# EAGLE design XmasTreeCard (EAGLE 7.1.0)
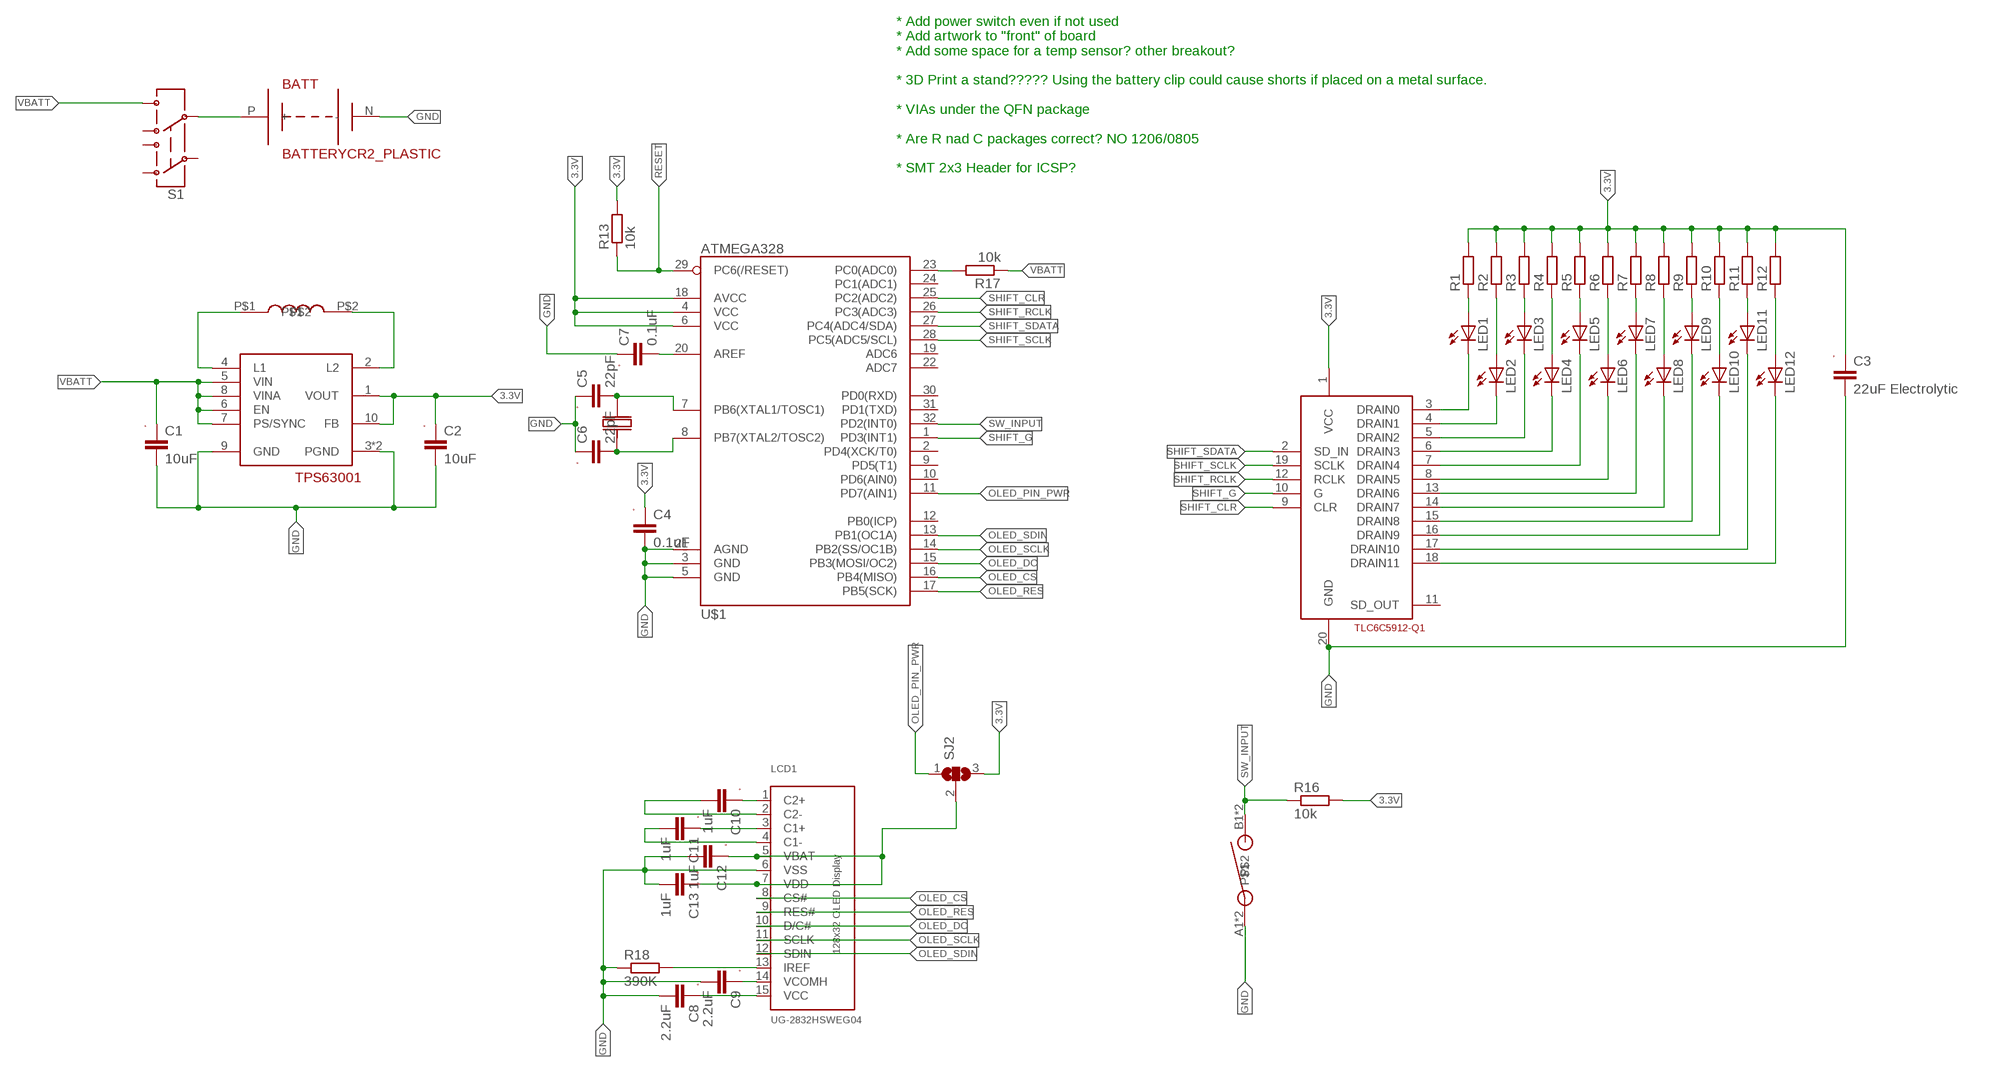
[diagram p0: schematic, sheet 1]

## Parts
BATT  BATTERYCR2_PLASTIC  [BATT_SMD_CR2_PLASTIC]
C1  10uF  C-EUC1206  [C1206]
C2  10uF  C-EUC1206  [C1206]
C3  22uF Electrolytic  C-EUAVX_TAJ_P  [CAP_2012-15]
C4  0.1uF  C-EUC0805K  [C0805K]
C5  22pF  C-EUC0805K  [C0805K]
C6  22pF  C-EUC0805K  [C0805K]
C7  0.1uF  C-EUC0805K  [C0805K]
C8  2.2uF  C-EUC1206  [C1206]
C9  2.2uF  C-EUC1206  [C1206]
C10  1uF  C-EUC1206  [C1206]
C11  1uF  C-EUC1206  [C1206]
C12  1uF  C-EUC1206  [C1206]
C13  1uF  C-EUC1206  [C1206]
LCD1  UG-2832HSWEG04  OLED_UG-2832HSWEG04FOLDAROUND  [UG-283HSWEG04_FOLDAROUND]
LED1  LEDCHIPLED_0805  [CHIPLED_0805]
LED2  LEDCHIPLED_0805  [CHIPLED_0805]
LED3  LEDCHIPLED_0805  [CHIPLED_0805]
LED4  LEDCHIPLED_0805  [CHIPLED_0805]
LED5  LEDCHIPLED_0805  [CHIPLED_0805]
LED6  LEDCHIPLED_0805  [CHIPLED_0805]
LED7  LEDCHIPLED_0805  [CHIPLED_0805]
LED8  LEDCHIPLED_0805  [CHIPLED_0805]
LED9  LEDCHIPLED_0805  [CHIPLED_0805]
LED10  LEDCHIPLED_0805  [CHIPLED_0805]
LED11  LEDCHIPLED_0805  [CHIPLED_0805]
LED12  LEDCHIPLED_0805  [CHIPLED_0805]
R1  R-EUR0805  [R0805]
R2  R-EUR0805  [R0805]
R3  R-EUR0805  [R0805]
R4  R-EUR0805  [R0805]
R5  R-EUR0805  [R0805]
R6  R-EUR0805  [R0805]
R7  R-EUR0805  [R0805]
R8  R-EUR0805  [R0805]
R9  R-EUR0805  [R0805]
R10  R-EUR0805  [R0805]
R11  R-EUR0805  [R0805]
R12  R-EUR0805  [R0805]
R13  10k  R-EUR0805  [R0805]
R16  10k  R-EUR0805  [R0805]
R17  10k  R-EUR0805  [R0805]
R18  390K  R-EUR0805  [R0805]
S1  SWITCH-DPDTMMS228  [MMS_228_T]
SJ2  SJ2W  [SJ_2]
SW1  SWITCH_SPST6X6TACTILE  [SWITCH_SPST_6X6_TACTILE]
U$1  ATMEGA328  ATMEGA328_SMT  [TQFP32-08]
U$2  COILCRAFT_LPS4012  [COILCRAFT_LPS4012]
U$3  TPS63001DRC  [QFN10_3X3MM]
U$4  TLC6C5912-Q1  [TSSOP-20]
U$5  CRYSTAL_ABM03  [ABM_CRYSTAL]

## Nets
3.3V: C2.1 C3.P C4.1 R1.2 R2.2 R3.2 R4.2 R5.2 R6.2 R7.2 R8.2 R9.2 R10.2 R11.2 R12.2 R13.2 R16.2 SJ2.3 U$1.4(VCC) U$1.6(VCC) U$1.18(AVCC) U$3.1(VOUT) U$3.10(FB) U$4.1(VCC)
GND: BATT.N(-) C1.2 C2.2 C3.N C4.2 C5.1 C6.1 C7.1 C8.2 C9.2 C12.2 C13.2 LCD1.6(VSS) R18.1 SW1.A1 SW1.A2 U$1.3(GND) U$1.5(GND) U$1.21(AGND) U$3.3(PGND) U$3.9(GND) U$3.11(PGND) U$4.20(GND)
N$1: U$2.P$1 U$3.4(L1)
N$2: U$2.P$2 U$3.2(L2)
N$3: LED1.A R1.1
N$4: LED2.A R2.1
N$5: LED3.A R3.1
N$6: LED4.A R4.1
N$7: LED5.A R5.1
N$8: LED6.A R6.1
N$9: LED7.A R7.1
N$10: LED8.A R8.1
N$11: LED9.A R9.1
N$12: LED10.A R10.1
N$13: LED11.A R11.1
N$14: LED12.A R12.1
N$15: LED1.C U$4.3(DRAIN0)
N$16: LED2.C U$4.4(DRAIN1)
N$17: LED3.C U$4.5(DRAIN2)
N$18: LED4.C U$4.6(DRAIN3)
N$19: LED5.C U$4.7(DRAIN4)
N$20: LED6.C U$4.8(DRAIN5)
N$21: LED7.C U$4.13(DRAIN6)
N$22: LED8.C U$4.14(DRAIN7)
N$23: LED9.C U$4.15(DRAIN8)
N$24: LED10.C U$4.16(DRAIN9)
N$25: LED11.C U$4.17(DRAIN10)
N$26: LED12.C U$4.18(DRAIN11)
N$27: C5.2 U$1.7(PB6(XTAL1/TOSC1)) U$5.2
N$28: BATT.P(+) S1.6
N$29: C6.2 U$1.8(PB7(XTAL2/TOSC2)) U$5.1
N$30: C7.2 U$1.20(AREF)
N$39: R17.2 U$1.23(PC0(ADC0))
N$40: C10.2 LCD1.2(C2-)
N$41: C10.1 LCD1.1(C2+)
N$42: C11.2 LCD1.4(C1-)
N$43: C11.1 LCD1.3(C1+)
N$44: LCD1.13(IREF) R18.2
N$45: C9.1 LCD1.14(VCOMH)
N$51: C8.1 LCD1.15(VCC)
N$52: C12.1 C13.1 LCD1.5(VBAT) LCD1.7(VDD) SJ2.2
OLED_CS: LCD1.8(CS#) U$1.16(PB4(MISO))
OLED_DC: LCD1.10(D/C#) U$1.15(PB3(MOSI/OC2))
OLED_PIN_PWR: SJ2.1 U$1.11(PD7(AIN1))
OLED_RES: LCD1.9(RES#) U$1.17(PB5(SCK))
OLED_SCLK: LCD1.11(SCLK) U$1.14(PB2(SS/OC1B))
OLED_SDIN: LCD1.12(SDIN) U$1.13(PB1(OC1A))
RESET: R13.1 U$1.29(PC6(/RESET))
SHIFT_CLR: U$1.25(PC2(ADC2)) U$4.9(CLR)
SHIFT_G: U$1.1(PD3(INT1)) U$4.10(G)
SHIFT_RCLK: U$1.26(PC3(ADC3)) U$4.12(RCLK)
SHIFT_SCLK: U$1.28(PC5(ADC5/SCL)) U$4.19(SCLK)
SHIFT_SDATA: U$1.27(PC4(ADC4/SDA)) U$4.2(SD_IN)
SW_INPUT: R16.1 SW1.B1 SW1.B2 U$1.32(PD2(INT0))
VBATT: C1.1 R17.1 S1.7 U$3.5(VIN) U$3.6(EN) U$3.7(PS/SYNC) U$3.8(VINA)
Unconnected: S1.1 S1.2 S1.3 S1.5 U$1.2(PD4(XCK/T0)) U$1.9(PD5(T1)) U$1.10(PD6(AIN0)) U$1.12(PB0(ICP)) U$1.19(ADC6) U$1.22(ADC7) U$1.24(PC1(ADC1)) U$1.30(PD0(RXD)) U$1.31(PD1(TXD)) U$4.11(SD_OUT)

## Notes on the sheet
- * Add power switch even if not used
  * Add artwork to "front" of board
  * Add some space for a temp sensor? other breakout?
  
  * 3D Print a stand????? Using the battery clip could cause shorts if placed on a metal surface.
  
  * VIAs under the QFN package
  
  * Are R nad C packages correct? NO 1206/0805
  
  * SMT 2x3 Header for ICSP?

## Library data of the parts
BATT = mjholmes:BATTERY: Battery connector - SMT Snap in round cell holders for AA, AAA and CR2 Keystone P/N 53 See http://www.keyelco.com/product.cfm/For-CR2-Batteries/53/product_id/811
C1 C2 C4-C13 = mjholmes:C-EU: CAPACITOR, European symbol; SPICEPREFIX: C
C3 = mjholmes:C-EU: CAPACITOR, European symbol
LCD1 = mjholmes:OLED_UG-2832HSWEG04: 128x32 SPI 0.91" Monochrome OLED Display
LED1-LED12 = led:LED: LED OSRAM: - CHIPLED LG R971, LG N971, LY N971, LG Q971, LY Q971, LO R971, LY R971 LH N974, LH R974 LS Q976, LO Q976, LY Q976 LO Q996 - Hyper CHIPLED LW Q18S LB Q993, LB Q99A, LB R99A - SideLED LS A670, LO A670, LY A670, LG A670, LP A670 LB A673, LV A673, LT A673, LW A673 LH A674 LY A675 LS A676, LA A676, LO A676, LY A676, LW A676 LS A679, LY A679, LG A679 - Hyper Micro SIDELED® LS Y876, LA Y876, LO Y876, LY Y876 LT Y87S - SmartLED LW L88C, LW L88S LB L89C, LB L89S, LG L890 LS L89K, LO L89K, LY L89K LS L896, LA L896, LO L896, LY L896 - TOPLED LS T670, LO T670, LY T670, LG T670, LP T670 LSG T670, LSP T670, LSY T670, LOP T670, LYG T670 LG T671, LOG T671, LSG T671 LB T673, LV T673, LT T673, LW T673 LH T674 LS T676, LA T676, LO T676, LY T676, LB T676, LH T676, LSB T676, LW T676 LB T67C, LV T67C, LT T67C, LS T67K, LO T67K, LY T67K, LW E67C LS E67B, LA E67B, LO E67B, LY E67B, LB E67C, LV E67C, LT E67C LW T67C LS T679, LY T679, LG T679 LS T770, LO T770, LY T770, LG T770, LP T770 LB T773, LV T773, LT T773, LW T773 LH T774 LS E675, LA E675, LY E675, LS T675 LS T776, LA T776, LO T776, LY T776, LB T776 LHGB T686 LT T68C, LB T68C - Hyper Mini TOPLED® LB M676 - Mini TOPLED Santana® LG M470 LS M47K, LO M47K, LY M47K Source: http://www.osram.convergy.de LUXEON: - LUMILED® LXK2-PW12-R00, LXK2-PW12-S00, LXK2-PW14-U00, LXK2-PW14-V00 LXK2-PM12-R00, LXK2-PM12-S00, LXK2-PM14-U00 LXK2-PE12-Q00, LXK2-PE12-R00, LXK2-PE12-S00, LXK2-PE14-T00, LXK2-PE14-U00 LXK2-PB12-K00, LXK2-PB12-L00, LXK2-PB12-M00, LXK2-PB14-N00, LXK2-PB14-P00, LXK2-PB14-Q00 LXK2-PR12-L00, LXK2-PR12-M00, LXK2-PR14-Q00, LXK2-PR14-R00 LXK2-PD12-Q00, LXK2-PD12-R00, LXK2-PD12-S00 LXK2-PH12-R00, LXK2-PH12-S00 LXK2-PL12-P00, LXK2-PL12-Q00, LXK2-PL12-R00 Source: www.luxeon.com KINGBRIGHT: KA-3528ASYC Source: www.kingbright.com
R1-R13 R16-R18 = mjholmes:R-EU: RESISTOR, European symbol; SPICEPREFIX: R
S1 = mjholmes:SWITCH-DPDT: DPDT Version of the COM-00597
SJ2 = mjholmes:SJ2W: SMD solder JUMPER
SW1 = mjholmes:SWITCH_SPST: Mountain switch Part number 101-TS6923T2605-EV http://www.mouser.com/ds/2/209/MS-100637-199674.pdf
U$1 = mjholmes:ATMEGA328_SMT: Atmega328 TQFP or DIP28; FARNELL: 171-5486
U$2 = mjholmes:COILCRAFT_LPS4012: Coilcraft Shielded Power Inductors – LPS4012 See http://www.coilcraft.com/pdfs/lps4012.pdf Very low DCR; excellent current handling 4.0 × 4.0 mm footprint; less than 1.2 mm tall
U$3 = mjholmes:TPS63001: HIGH EFFICIENT SINGLE INDUCTOR BUCK-BOOST CONVERTER WITH 1.8-A SWITCHES
U$4 = mjholmes:TLC6C5912-Q1: TI Power Logic 12-CHANNEL SHIFT REGISTER LED DRIVER See http://www.ti.com/lit/ds/symlink/tlc6c5912-q1.pdf; MOUSER: 595-TLC6C5912QPWRQ1
U$5 = mjholmes:CRYSTAL

## Board
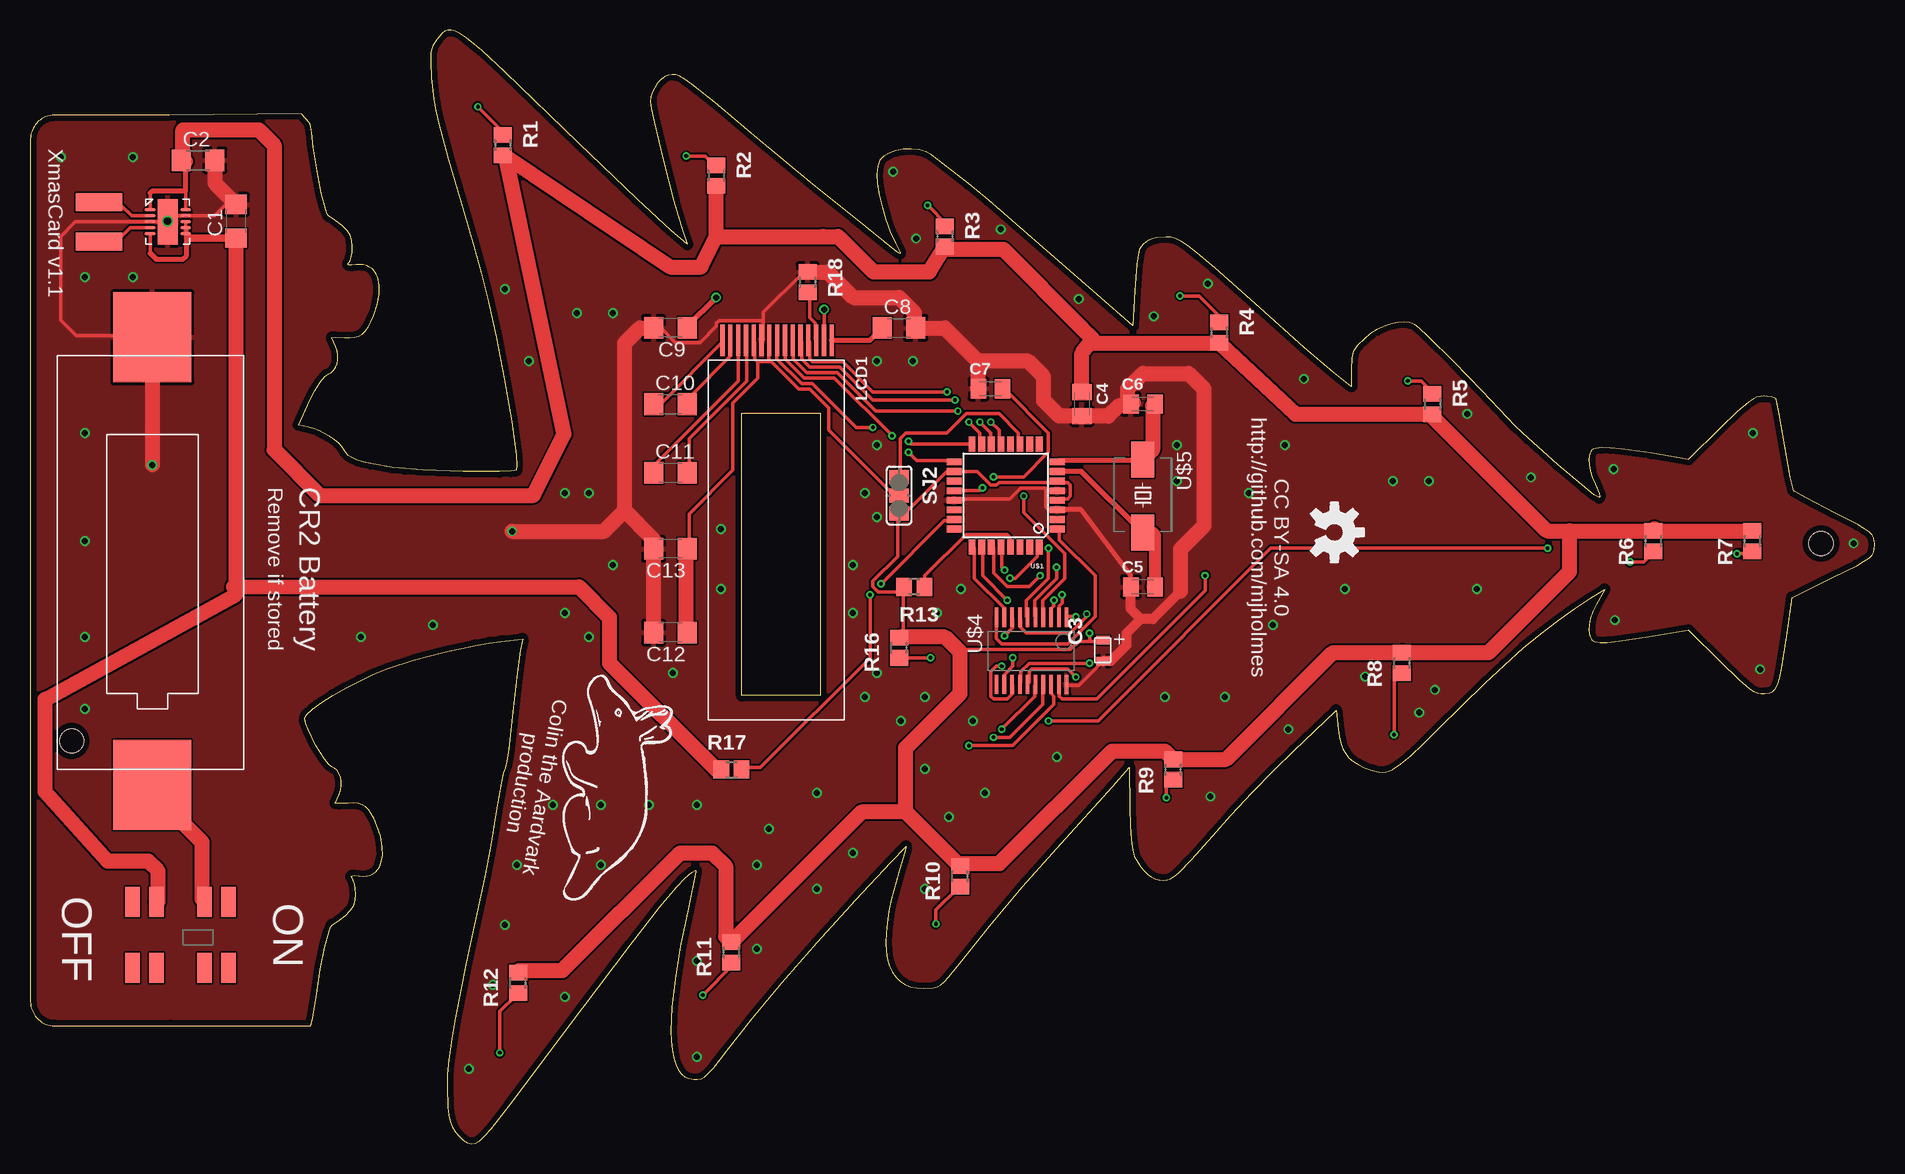
[diagram p1: board, top side]
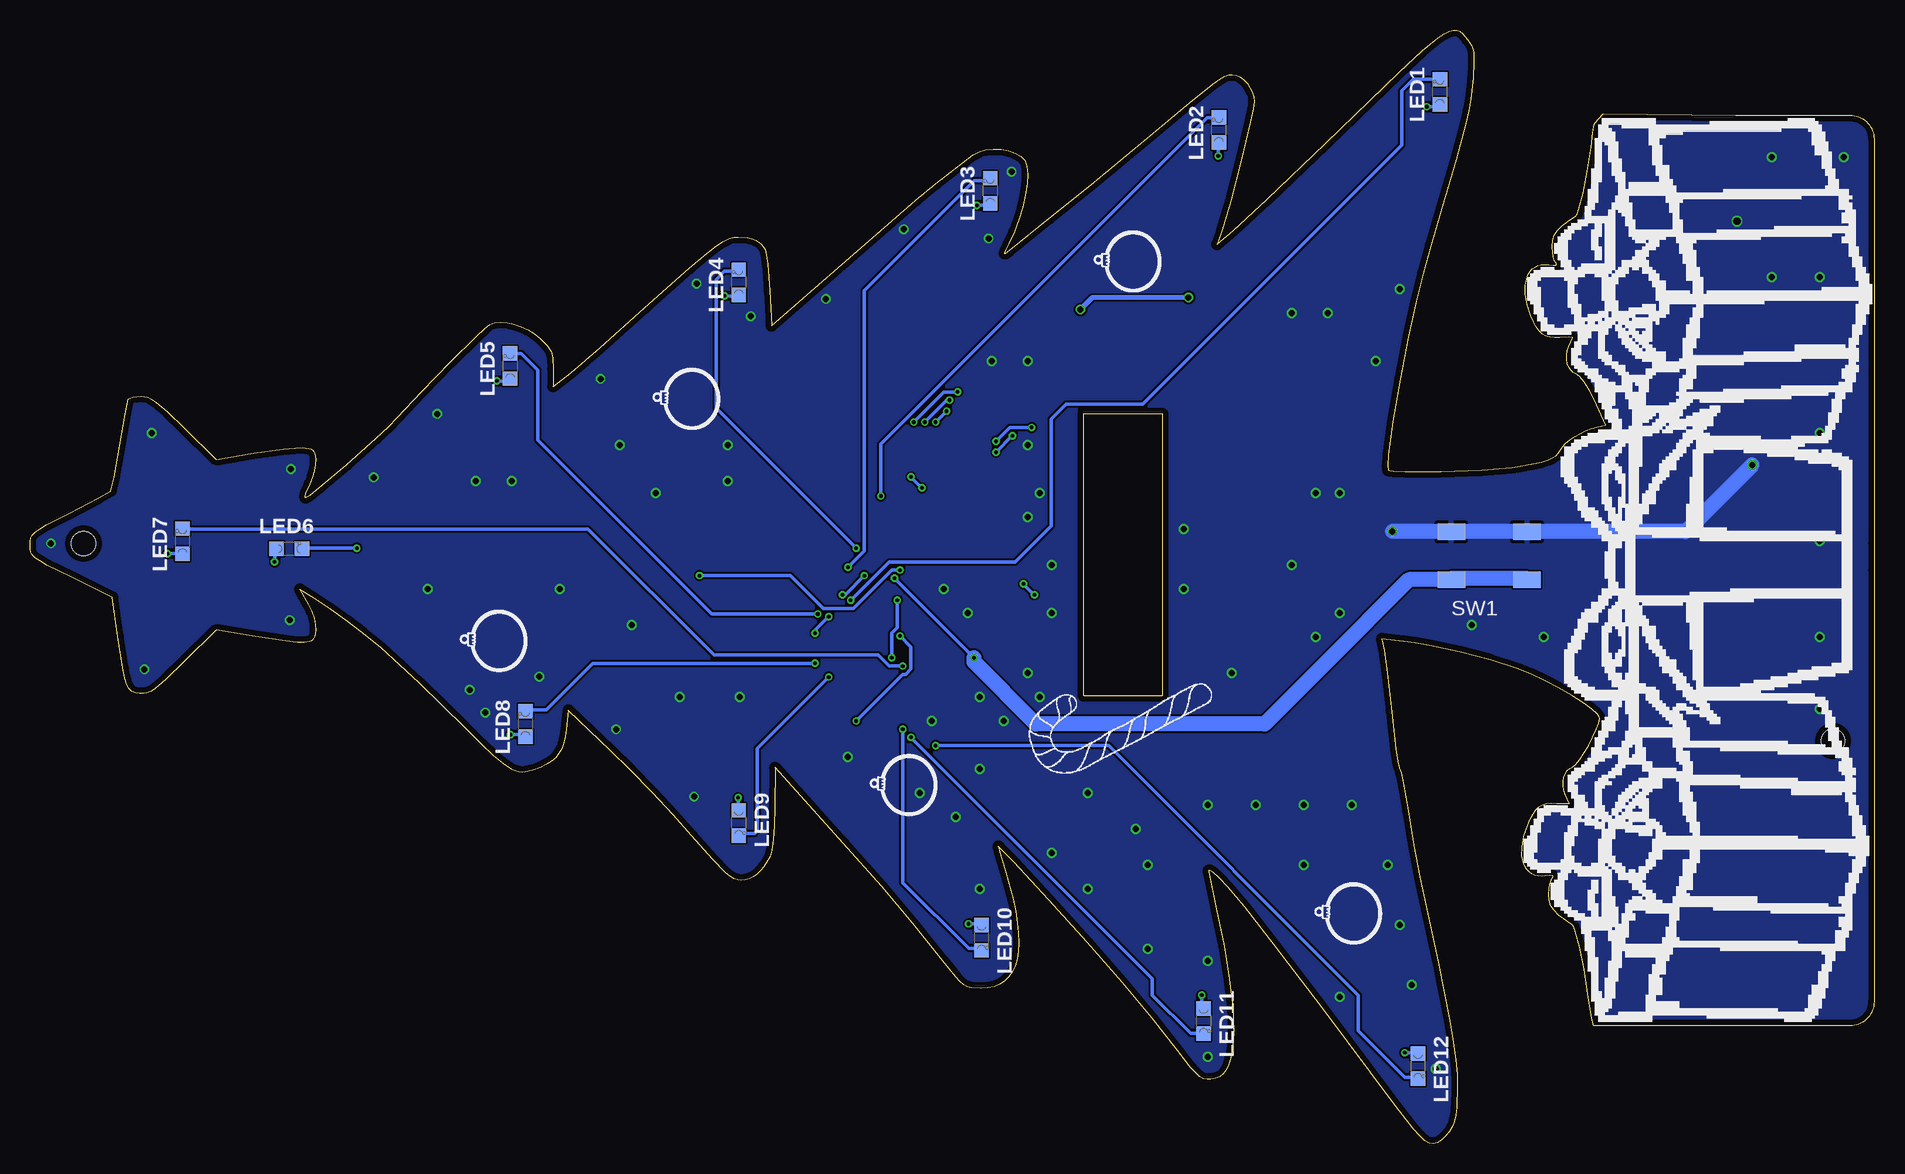
[diagram p2: board, bottom side, seen from below]

Size 153.67 x 92.85 mm. Coordinates in mm from the lower left corner, seen from the top.
Outline: 153.67,50.07 153.66,50.24 153.62,50.51 153.48,50.75 153.25,50.99 152.85,51.27 152.26,51.6 150.36,52.59 147.98,53.83 146.92,54.43 146.67,55.6 146.21,58.21 145.75,60.85 145.47,62.08 145.34,62.18 145.1,62.26 144.42,62.33 144.14,62.31 143.85,62.23 143.55,62.08 143.19,61.84 142.24,61.04 140.84,59.69 138.15,57.04 135.04,57.56 132.56,57.92 131.59,58.01 130.95,58.02 130.42,57.96 130.25,57.91 130.11,57.82 130.02,57.71 129.95,57.54 129.88,57.06 129.89,56.62 129.98,56.09 130.15,55.54 130.38,55.02 130.72,54.2 130.77,53.96 130.76,53.94 arc-52 130.71,53.86 130.33,54.09 129.55,54.69 127.26,56.61 124.8,58.83 123.79,59.79 123.08,60.52 121.04,62.71 118.6,65.2 116.48,67.3 115.75,67.98 115.35,68.3 114.93,68.45 114.45,68.5 113.91,68.46 113.34,68.34 112.76,68.14 112.19,67.87 111.65,67.53 111.17,67.13 110.58,66.53 110.38,66.27 110.24,66.02 110.15,65.75 110.1,65.44 110.07,64.61 110.07,63.13 108.58,64.3 106.16,66.37 102.42,69.69 98.72,72.99 97.5,74.04 96.61,74.76 95.95,75.21 95.45,75.47 95.04,75.57 94.63,75.59 93.84,75.53 93.5,75.44 93.2,75.33 92.95,75.18 92.73,75 92.55,74.79 92.41,74.54 92.31,74.12 92.21,73.33 92.03,71.12 91.86,68.19 88.9,70.79 81.83,76.98 79.85,78.65 78.18,80.03 75.08,82.45 74.59,82.7 74.01,82.86 73.39,82.92 72.74,82.89 72.13,82.78 71.57,82.59 71.1,82.32 70.78,81.98 70.67,81.77 70.6,81.51 70.54,80.84 70.58,80.02 70.72,79.08 70.96,78.07 71.27,77.03 71.67,76 72.12,75.02 72.39,74.47 72.47,74.24 72.44,74.22 72.35,74.25 72.03,74.48 68.72,77.14 65.23,79.97 60.3,84.06 57.04,86.8 55.12,88.34 54.52,88.75 54.09,89 53.75,89.11 53.46,89.14 53.15,89.09 52.84,88.94 52.53,88.7 52.25,88.4 52.01,88.04 51.81,87.67 51.69,87.28 51.65,86.89 51.73,86.27 51.96,85.15 52.72,81.98 53.6,78.59 54.32,76.19 54.74,74.98 53.38,76.13 50.56,78.74 45.69,83.43 39.58,89.35 37.67,91.11 36.32,92.22 35.82,92.55 35.4,92.75 35.07,92.85 34.78,92.83 34.54,92.74 34.32,92.56 33.86,92.03 33.53,91.55 33.43,91.3 33.36,91 33.34,90.18 33.41,88.86 33.6,87.09 33.78,86.13 34.03,85.04 34.81,82.1 36.11,77.71 36.95,74.85 37.58,72.58 38.14,70.26 38.81,67.27 39.49,63.75 40.09,60.19 40.46,57.4 40.53,56.53 40.5,56.16 40.36,56.12 40.06,56.07 39.07,56.03 36.06,56.04 32.68,56.17 31.22,56.27 30.14,56.39 28.36,56.7 27.71,56.85 27.19,57.02 26.78,57.19 26.48,57.39 26.26,57.62 26.11,57.86 25.94,58.13 25.67,58.41 25.33,58.69 24.93,58.97 24.02,59.45 23.56,59.64 23.1,59.76 22.35,59.93 23.29,61.96 23.73,62.82 24.15,63.49 24.52,63.95 24.68,64.08 24.83,64.16 25.07,64.28 25.29,64.49 25.44,64.74 25.56,65.05 25.62,65.39 25.62,65.74 25.56,66.1 25.44,66.45 25.12,67.22 25.44,67.24 26.18,67.2 26.63,67.19 27.01,67.23 27.35,67.33 27.64,67.5 27.9,67.74 28.13,68.08 28.36,68.51 28.59,69.04 28.9,69.97 29.05,70.83 29.06,71.59 28.92,72.23 28.8,72.5 28.65,72.73 28.47,72.94 28.25,73.1 28.01,73.21 27.73,73.28 27.43,73.31 27.1,73.28 26.73,73.24 26.51,73.25 26.44,73.32 26.52,73.44 26.63,73.63 26.73,73.95 26.79,74.35 26.81,74.78 26.78,75.32 26.64,75.76 26.38,76.14 25.97,76.54 25.3,77.06 24.86,77.33 24.75,77.5 24.6,77.89 24.24,79.23 23.88,81.06 23.57,83.07 23.45,84.29 23.37,84.8 23.31,84.98 23.24,85.12 22.58,85.86 11.54,85.75 2,85.75 arc90 0,83.75 0,50.07 0,47.79 0,11.83 arc90 2,9.83 11.69,9.83 23.36,9.83 23.52,10.47 23.86,12.51 24.17,14.53 24.53,16.36 24.88,17.7 25.03,18.1 25.14,18.26 25.59,18.54 26.26,19.06 26.66,19.46 26.93,19.83 27.06,20.28 27.09,20.81 27.08,21.25 27.01,21.63 26.92,21.95 26.8,22.15 26.72,22.27 26.79,22.34 27.01,22.36 27.38,22.31 27.71,22.29 28.01,22.31 28.29,22.38 28.53,22.5 28.75,22.66 28.94,22.86 29.09,23.09 29.2,23.36 29.34,24.01 29.33,24.76 29.18,25.62 28.87,26.56 28.65,27.08 28.42,27.51 28.18,27.84 27.92,28.1 27.63,28.27 27.3,28.36 26.91,28.41 26.46,28.39 25.72,28.35 25.4,28.37 25.72,29.14 25.84,29.48 25.9,29.84 25.9,30.21 25.84,30.54 25.73,30.84 25.57,31.11 25.36,31.3 25.11,31.43 24.86,31.62 24.54,32.02 23.79,33.21 23.14,34.52 22.94,35.06 22.86,35.45 22.9,35.6 23.04,35.78 23.51,36.24 24.25,36.78 25.19,37.38 26.26,37.99 27.42,38.59 28.62,39.15 29.79,39.62 31.95,40.31 34.52,40.99 37.07,41.55 38.21,41.75 39.2,41.89 41.01,42.1 40.82,41.13 40.55,39.23 40.21,36 39.85,32.91 39.68,31.86 39.55,31.34 39.41,30.91 39.23,30.09 38.83,27.75 38.36,24.86 37.84,22.25 36.31,15.12 35.35,10.24 35.05,8.45 34.85,6.98 34.75,5.79 34.71,4.75 34.77,3.03 34.85,2.38 34.98,1.84 35.15,1.39 35.39,1.01 35.7,0.65 36.08,0.31 36.41,0.1 36.72,0 37.05,0.05 37.42,0.26 37.86,0.66 38.4,1.25 39.86,3.13 46,11.33 50.01,16.62 52.44,19.73 53.87,21.4 54.57,22.15 55.09,22.61 55.39,22.79 55.45,22.77 55.46,22.67 54.8,19.57 54.16,16.47 53.72,13.73 53.45,11.38 53.38,9.4 53.4,8.56 53.47,7.82 53.6,7.17 53.75,6.62 53.97,6.18 54.22,5.83 54.53,5.58 54.87,5.44 55.25,5.36 55.58,5.35 55.88,5.42 56.19,5.6 56.53,5.91 56.94,6.35 58.04,7.76 60.14,10.45 62.65,13.47 65.55,16.78 68.79,20.35 71.71,23.49 72.96,24.79 72.81,24.16 72.35,22.6 71.75,20.37 71.53,19.36 71.38,18.42 71.3,17.56 71.27,16.77 71.31,16.04 71.41,15.4 71.57,14.83 71.8,14.33 72.09,13.91 72.43,13.56 72.85,13.29 73.32,13.1 73.85,12.98 74.45,12.94 75.25,12.98 75.56,13.07 75.85,13.24 76.16,13.51 76.53,13.93 77.61,15.27 80.12,18.37 82.7,21.44 85.88,25.06 90.17,29.8 91.58,31.35 91.61,28 91.63,26.52 91.71,25.34 91.84,24.47 92,23.94 92.53,23.08 92.82,22.75 93.11,22.46 93.42,22.25 93.73,22.09 94.07,22 94.4,21.97 94.69,22 94.99,22.09 95.3,22.28 95.69,22.6 96.78,23.72 98.52,25.68 100.05,27.39 101.83,29.29 103.65,31.17 105.27,32.76 108.8,36.14 108.97,34.55 109.06,33.94 109.19,33.4 109.37,32.93 109.59,32.53 109.87,32.18 110.22,31.88 110.63,31.63 111.12,31.39 111.8,31.12 112.39,30.98 112.67,30.97 112.95,31.01 113.23,31.09 113.53,31.22 114.2,31.65 115.01,32.34 116.05,33.32 117.34,34.62 121.17,38.36 122.85,39.93 124.42,41.31 125.9,42.54 127.3,43.62 128.67,44.6 130.01,45.48 131.18,46.21 130.48,44.97 130.19,44.38 129.99,43.81 129.88,43.28 129.87,42.8 129.95,42.32 130.1,42.02 130.22,41.93 130.37,41.87 130.81,41.79 131.4,41.8 132.36,41.9 134.9,42.27 138.15,42.83 140.86,40.15 142.35,38.69 143.28,37.9 143.62,37.69 143.92,37.57 144.21,37.54 144.51,37.54 144.88,37.6 145.18,37.7 145.41,37.91 145.6,38.28 145.77,38.84 145.94,39.67 146.34,42.3 146.81,45.54 150.24,47.24 152.21,48.22 152.82,48.56 153.24,48.83 153.48,49.08 153.62,49.32 153.66,49.58 153.67,49.91 153.67,50.07
Outline: 153.67,50.07 153.67,50.07
Copper layers (1*16): Top 0.035mm / dielectric 1.5mm / Bottom 0.035mm
Design rules "hackvana_mjh *": minimum track width 10mil, minimum drill 0.3mm, track to track 6mil, track to pad 6mil, pad to pad 6mil, via to via 6mil, smd to smd 0mil, copper to edge 20mil, drill to drill 6mil, minimum pad ring 10mil, minimum via ring 6mil, stop-mask expansion 2mil, vias tented up to drill 100mil, thermal gap 10mil
Holes 2 mm at 149.21,50.05

### Footprints (pad centres in the part's own frame; a part is rotated, then mirrored left to right if it is on the bottom)
BATT_SMD_CR2_PLASTIC = smd 7.5 x 6.5: N 37.32,0; P 0,0 | hole 1.98: 3.67,6.73
C1206 = smd 1.6 x 1.8: 1 -1.4,0; 2 1.4,0
CAP_2012-15 = smd 0.7 x 1.1: N 1.75,-3; P 0,-3
C0805K = smd 1.3 x 1.6: 1 -1,0; 2 1,0
UG-283HSWEG04_FOLDAROUND = smd 2.6 x 0.35: 1 -18.017,-4.55; 2 -18.017,-3.9; 3 -18.017,-3.25; 4 -18.017,-2.6; 5 -18.017,-1.95; 6 -18.017,-1.3; 7 -18.017,-0.65; 8 -18.017,0; 9 -18.017,0.65; 10 -18.017,1.3; 11 -18.017,1.95; 12 -18.017,2.6; 13 -18.017,3.25; 14 -18.017,3.9; 15 -18.017,4.55
CHIPLED_0805 = smd 1.2 x 1.2: A 0,-1.05; C 0,1.05
R0805 = smd 1.3 x 1.5: 1 -0.85,0; 2 0.85,0
MMS_228_T = smd 1.2 x 2.5: 1 0,0; 2 2,0; 3 6,0; 4 8,0; 5 0,-5.5; 6 2,-5.5; 7 6,-5.5; 8 8,-5.5
SJ_2 = smd 1.168 x 1.6: 1 -1.524,0; 2 0,0; 3 1.524,0
SWITCH_SPST_6X6_TACTILE = smd 2.3 x 1.4: A1 -3,2; A2 3.3,2; B1 -3,-2; B2 3.3,-2
TQFP32-08 = smd 1.27 x 0.559: 1 -4.293,2.8; 2 -4.293,2; 3 -4.293,1.2; 4 -4.293,0.4; 5 -4.293,-0.4; 6 -4.293,-1.2; 7 -4.293,-2; 8 -4.293,-2.8; 17 4.293,-2.8; 18 4.293,-2; 19 4.293,-1.2; 20 4.293,-0.4; 21 4.293,0.4; 22 4.293,1.2; 23 4.293,2; 24 4.293,2.8 | smd 0.559 x 1.27: 9 -2.8,-4.293; 10 -2,-4.293; 11 -1.2,-4.293; 12 -0.4,-4.293; 13 0.4,-4.293; 14 1.2,-4.293; 15 2,-4.293; 16 2.8,-4.293; 25 2.8,4.293; 26 2,4.293; 27 1.2,4.293; 28 0.4,4.293; 29 -0.4,4.293; 30 -1.2,4.293; 31 -2,4.293; 32 -2.8,4.293
COILCRAFT_LPS4012 = smd 1.5 x 3.9: P$1 -1.7,0; P$2 1.6,0
QFN10_3X3MM = smd 0.87 x 0.28: 1 -1.46,0.95; 2 -1.46,0.45; 3 -1.46,-0.05; 4 -1.46,-0.55; 5 -1.46,-1.05; 6 1.51,-1.05; 7 1.51,-0.55; 8 1.51,-0.05; 9 1.51,0.45; 10 1.51,0.95 | smd 1.64 x 3.8: 11 0.025,-0.05
TSSOP-20 = smd 1.6 x 0.3: 1 0,2.54; 2 0,1.89; 3 0,1.24; 4 0,0.59; 5 0,-0.06; 6 0,-0.71; 7 0,-1.36; 8 0,-2.01; 9 0,-2.66; 10 0,-3.31; 11 5.6,-3.31; 12 5.6,-2.66; 13 5.6,-2.01; 14 5.6,-1.36; 15 5.6,-0.71; 16 5.6,-0.06; 17 5.6,0.59; 18 5.6,1.24; 19 5.6,1.89; 20 5.6,2.54
ABM_CRYSTAL = smd 3 x 1.93: 1 -3,0; 2 3.1,0

### Placement (x,y rotation side)
BATT  10.15,29.92 90 top
C1  17.13,76.91 90 top
C2  13.96,81.99 0 top
C3  92.38,41.98 270 top
C4  87.62,61.67 270 top
C5  92.7,46.43 0 top
C6  92.7,61.67 0 top
C7  80,62.94 0 top
C8  72.38,68.02 0 top
C9  53.33,68.02 180 top
C10  53.33,61.67 0 top
C11  53.33,55.95 0 top
C12  53.33,42.62 180 top
C13  53.33,49.6 180 top
LCD1  62.22,48.97 270 top
LED1  36.18,87.7 0 bottom
LED2  54.6,84.53 0 bottom
LED3  73.65,79.45 0 bottom
LED4  94.6,71.83 0 bottom
LED5  113.65,64.84 0 bottom
LED6  132.07,49.6 270 bottom
LED7  140.96,50.24 0 bottom
LED8  112.38,35 0 bottom
LED9  94.6,26.74 180 bottom
LED10  74.37,17.18 180 bottom
LED11  55.87,10.23 180 bottom
LED12  38,6.47 180 bottom
R1  39.36,83.26 270 top
R2  57.14,80.72 270 top
R3  76.19,75.64 270 top
R4  99.05,67.62 270 top
R5  116.83,61.67 270 top
R6  135.24,50.24 90 top
R7  143.5,50.24 90 top
R8  114.29,40.08 90 top
R9  95.24,31.19 90 top
R10  77.46,22.3 90 top
R11  58.41,15.95 90 top
R12  40.63,13.41 90 top
R13  73.65,46.43 180 top
R16  72.38,41.35 90 top
R17  58.41,31.19 0 top
R18  64.76,71.83 270 top
S1  16.5,14.68 180 top
SJ2  72.38,54.05 270 top
SW1  32.22,49.03 0 bottom
U$1  81.27,54.05 180 top
U$2  5.7,76.91 90 top
U$3  11.42,76.91 0 top
U$4  83.81,43.89 270 top
U$5  92.7,54.05 270 top
U$6  [OSHW-LOGO-M]  108.66,50.96 270 top

### Tracks (layer width: path | path; a pad name or v marks a point on that pad's centre or on a via)
3.3V  (via drill 0.3)
  Top 0.305: U$3.10 12.93,79.45 | U$3.1 9.96,79.26 | 57.16,79.83 R2.2 56.94,79.83 | 39.56,82.34 R1.2 | 42.31,54.45 41.9,54.05 | 135.35,51.25 R6.2 135.12,51.25 | 143.35,51.25 R7.2 | 99.13,66.72 R4.2 99,67.25 | 116.83,60.85 R5.2 116.83,60.62 | 40.71,14.45 R12.2 | 58.31,16.96 R11.2 | U$1.4 85.74,53.77 86.43,53.77 86.65,53.99 86.65,54.91 86.43,55.14 85.74,55.14 U$1.6 85.51,55.14 80.71,55.14 80.48,54.91 80.02,54.91 78.88,56.05 77.05,56.05 U$1.18 76.82,56.05 76.37,56.05 72.94,52.62 72.48,52.62 SJ2.3 72.25,52.39 72.25,48.97 70.2,46.91 70.2,46.45 70.65,45.99 72.71,45.99 | 88.25,41.88 87.34,41.88 86.65,41.19 77.51,41.19 | 88.25,41.88 89.17,41.88 C3.P | 72.71,42.11 72.48,42.34 R16.2 72.71,42.11 | 72.71,42.11 72.71,45.99 | 72.71,45.99 72.71,46.22 R13.2 72.71,45.99 | 77.51,23.36 R10.2 | 95.11,32.05 R9.2 95.34,32.05 | 114.09,40.74 R8.2 114.31,40.96 | v87.11,43.94 86.43,43.94 U$4.1 | 88.25,41.88 v88.25,42.56 | 76.37,74.57 R3.2
  Top 0.406: C2.1 12.93,81.88 12.93,79.45 10.15,79.45 9.96,79.26 | 77.51,41.19 77.46,41.19 77.46,40.25
  Top 1.27: 12.93,81.88 12.69,82.12 12.69,84.53 19.04,84.53 20.31,83.26 20.31,57.86 24.12,54.05 41.9,54.05 44.44,59.13 39.56,82.34 53.33,73.1 55.87,73.1 57.14,75.64 | 57.14,75.64 R2.2 | 57.14,75.64 66.03,75.64 67.3,75.64 70.24,72.7 74.9,72.7 R3.2 | 76.37,74.57 81.07,74.57 87.62,68.02 88.47,67.17 88.29,66.77 | 88.29,66.77 R4.2 | 99.13,66.72 105.44,60.82 R5.2 | 116.83,60.62 126.37,51.09 128.26,51.09 | 128.26,51.09 R6.2 | 135.35,51.25 135.51,51.09 R7.2 | 114.31,40.96 114.33,40.95 119.63,40.95 121.51,40.95 128.26,47.7 128.26,51.09 | 95.34,32.05 99.63,32.05 108.53,40.95 114.27,40.95 R8.2 | 77.51,23.36 80.75,23.36 90.13,32.75 94.53,32.75 R9.2 | R10.2 77.43,23.15 72.93,27.65 | 72.93,27.65 69.26,27.65 R11.2 57.93,17.28 57.93,23.15 56.83,24.25 54.13,24.25 44.33,14.45 40.71,14.45 | 72.93,27.65 72.93,33.01 77.46,37.54 77.46,40.25 77.46,41.02 76.23,42.25 72.43,42.25 R16.2 | C4.1 87.62,65.9 88.29,66.77
  Bottom 0.305: v87.11,43.94 88.25,42.79 v88.25,42.56
GND  (via drill 0.5, 0.6 pad 0.81)
  Top 0.305: U$3.11 U$3.3 3.75,76.86 2.53,75.64 2.53,68.65 3.8,67.38 10,67.38 BATT.N | U$3.11 11.44,76.88 v11.42,76.91 11.42,77.22 11.1,77.54 | U$3.11 11.74,77.15 11.74,77.54 11.92,77.36 U$3.9 15.36,77.36 16.5,78.49 16.95,78.49 C1.2 | 51.91,49.42 C13.2 51.91,49.65 | 61.05,68.63 61.05,67.02 LCD1.6 | 61.05,68.63 61.05,69.31 64.25,72.51 64.71,72.51 R18.1 | 61.05,68.63 57.39,68.63 57.16,68.4 57.16,68.17 55.79,66.8 53.74,66.8 52.59,67.94 52.14,67.94 C9.2 | 84.6,54.68 82.54,54.68 81.63,53.77 77.05,53.77 U$1.21 | 84.6,54.68 84.83,54.45 85.51,54.45 U$1.5 | 84.6,54.68 84.6,53.08 84.83,52.85 85.51,52.85 U$1.3 85.74,52.85 86.2,52.85 | U$4.20 86.43,38.22 87.34,38.22 89.17,40.05 C3.N 89.4,40.28 | 91.68,46.22 C5.1 91.68,46.45 91.68,47.37 | 87.62,52.78 87.54,52.85 | 87.8,60.85 C4.2 | 91.68,61.54 C6.1 91.91,61.77 | 78.88,63.14 C7.1
  Top 0.406: 91.68,47.37 87.62,52.78 | 87.54,52.85 86.2,52.85
  Top 0.813: 95.83,46.05 93.53,43.75 92.53,43.75 | 92.53,43.75 91.7,44.58 C5.1 | 92.53,43.75 91.33,42.55 91.33,41.55 90.01,40.23 C3.N
  Top 1.27: C2.2 15.36,80.08 C1.2 | 91.68,61.54 90.72,61.54 89.83,60.65 87.64,60.65 C4.2 85.71,60.67 84.43,61.95 84.43,63.95 83.13,65.25 79.03,65.25 78.93,65.15 | R18.1 66.45,72.68 68.57,70.56 72.38,70.56 73.65,69.29 73.65,68.15 C8.2 76.19,68.02 78.73,65.48 78.73,65.45 78.93,65.25 78.93,65.15 | 78.93,65.15 78.93,63.01 C7.1 | C12.2 C13.2 | 51.91,49.65 51.91,50.39 49.52,52.78 | 49.52,52.78 49.52,66.75 50.79,68.02 C9.2 | BATT.N v10.15,56.59 | v40.13,51.05 47.79,51.05 49.52,52.78 | 91.91,61.77 91.43,62.25 91.43,62.94 92.7,64.21 96.51,64.21 97.78,62.94 97.78,51.51 95.83,49.56 95.83,46.05
  Bottom 1.27: v10.15,56.59 15.71,51.03 SW1.A2 SW1.A1 35.24,51.05 v40.13,51.05
  other vias: 104.83,34.55 98.33,28.95 94.53,37.25 99.53,37.25 103.53,43.25 109.53,46.25 120.53,46.25 113.53,55.25 116.53,55.25 101.53,54.25 111.23,38.95 115.73,35.95 117.03,37.85 132.03,43.65 144.13,39.55 131.93,56.25 125.03,55.55 151.93,50.05 143.53,59.25 119.73,60.85 104.53,58.25 95.53,58.25 95.53,55.25 85.53,32.25 79.53,29.25 76.53,27.25 74.53,21.25 68.53,24.25 65.53,21.25 60.53,16.25 60.53,23.25 61.53,26.25 65.53,29.25 55.53,28.25 51.53,28.25 53.53,39.25 78.53,35.25 74.53,31.25 72.53,35.25 74.53,37.25 69.53,37.25 70.53,39.25 77.53,46.25 75.53,44.25 68.53,44.25 68.53,48.25 70.53,52.25 69.53,54.25 70.53,58.25 73.53,65.25 70.53,65.25 55.53,7.25 55.53,15.25 44.53,12.25 38.53,13.25 39.53,18.25 36.53,6.25 47.53,28.25 43.53,28.25 40.53,23.25 47.53,23.25 57.53,51.25 57.53,46.25 46.53,42.25 48.53,48.25 44.53,44.25 33.53,43.25 27.53,42.25 44.53,54.25 46.53,54.25 4.53,36.25 4.53,42.25 4.53,50.25 4.53,59.25 8.53,72.25 4.53,72.25 2.53,82.25 8.53,82.25 48.53,69.25 39.53,71.25 45.53,69.25 41.53,65.25 71.88,81.04 73.79,75.47 80.86,76.23 87.35,70.43 93.6,68.98 98.12,71.7 106.12,63.76
  pour Bottom: -2.55,94.69 156.2,94.69 156.2,-1.83 -2.55,-1.83
  pour Top: -2.47,94.25 155.53,94.25 155.53,-1.75 -2.47,-1.75
N$1
  Top 0.305: U$3.4 8.33,76.36 7.29,75.32 5.82,75.32 U$2.P$1
N$2
  Top 0.305: U$3.2 8.43,77.36 7.61,78.18 6.03,78.18 U$2.P$2
N$3  (via drill 0.3)
  Top 0.305: v37.28,86.46 39.56,84.17 R1.1
  Bottom 0.305: v37.28,86.46 36.36,86.46 LED1.A
N$4  (via drill 0.3)
  Top 0.305: v54.65,82.34 56.25,82.34 56.94,81.66 R2.1
  Bottom 0.305: v54.65,82.34 54.65,83.26 LED2.A
N$5  (via drill 0.3)
  Top 0.305: v74.77,78.23 76.37,76.63 R3.1
  Bottom 0.305: v74.77,78.23 73.85,78.23 LED3.A
N$6  (via drill 0.3)
  Top 0.305: v95.8,70.68 97.4,70.68 99,69.08 R4.1
  Bottom 0.305: v95.8,70.68 94.66,70.68 LED4.A
N$7  (via drill 0.3)
  Top 0.305: v114.77,63.6 115.92,63.6 116.83,62.68 R5.1
  Bottom 0.305: v114.77,63.6 113.86,63.6 LED5.A
N$8  (via drill 0.3)
  Top 0.305: v133.29,48.51 134.43,48.51 135.12,49.19 R6.1
  Bottom 0.305: v133.29,48.51 133.29,49.42 LED6.A
N$9  (via drill 0.3)
  Top 0.305: v142.2,49.19 143.35,49.19 R7.1
  Bottom 0.305: v142.2,49.19 141.06,49.19 LED7.A
N$10  (via drill 0.3)
  Top 0.305: v113.63,34.11 113.63,38.68 114.09,39.14 R8.1
  Bottom 0.305: v113.63,34.11 112.49,34.11 LED8.A
N$11  (via drill 0.3)
  Top 0.305: v94.66,28.85 94.66,29.76 95.11,30.22 R9.1
  Bottom 0.305: v94.66,28.85 94.66,27.93 LED9.A
N$12  (via drill 0.3)
  Top 0.305: v75.45,18.33 75.45,19.48 77.28,21.3 R10.1
  Bottom 0.305: v75.45,18.33 74.54,18.33 LED10.A
N$13  (via drill 0.3)
  Top 0.305: v56.02,12.39 58.54,14.9 R11.1
  Bottom 0.305: v56.02,12.39 56.02,11.48 LED11.A
N$14  (via drill 0.3)
  Top 0.305: v39.11,7.59 39.11,11.02 40.48,12.39 R12.1
  Bottom 0.305: v39.11,7.59 38.19,7.59 LED12.A
N$15  (via drill 0.3)
  Top 0.305: v85.28,45.31 85.28,44.85 85.05,44.62 85.05,43.94 U$4.3
  Bottom 0.305: v85.28,45.31 82.08,48.51 80.48,48.51 71.57,48.51 68.57,51.51 68.57,60.4 67.3,61.67 60.95,61.67 48.25,74.37 39.36,83.26 39.36,87.8 38.42,88.74 36.36,88.74 LED1.C
N$16  (via drill 0.3)
  Top 0.305: v82.77,53.99 82.77,52.62 86.2,49.19 86.2,47.14 84.37,45.31 84.37,43.94 U$4.4
  Bottom 0.305: v82.77,53.99 82.77,58.34 55.56,85.54 54.65,85.54 LED2.C
N$17  (via drill 0.3)
  Top 0.305: v85.51,48.05 85.51,47.14 83.68,45.31 83.68,43.94 U$4.5
  Bottom 0.305: v85.51,48.05 84.14,49.42 84.14,71.14 75,80.28 73.85,80.28 LED3.C
N$18  (via drill 0.3)
  Top 0.305: v84.83,49.65 84.83,47.14 83,45.31 83,43.94 U$4.6
  Bottom 0.305: v84.83,49.65 96.48,61.31 96.48,72.05 95.8,72.74 94.66,72.74 LED4.C
N$19  (via drill 0.3)
  Top 0.305: v88.03,44.16 88.03,43.94 86.65,42.56 83,42.56 82.54,43.02 82.54,43.71 U$4.7
  Bottom 0.305: v88.03,44.16 96.87,44.16 111.34,58.64 111.34,64.51 112.71,65.88 113.63,65.88 LED5.C
N$20  (via drill 0.3)
  Top 0.305: v126.43,49.65 103.37,49.65 88.97,35.25 v84.83,35.25 | v81.17,42.34 81.85,43.02 81.85,43.71 U$4.8
  Bottom 0.305: v126.43,49.65 131,49.65 LED6.C | v84.83,35.25 80.94,39.14 80.71,39.14 80.25,39.59 80.25,41.42 v81.17,42.34
N$21  (via drill 0.3)
  Top 0.305: v80.94,39.82 80.48,39.82 80.02,39.36 80.02,37.31 80.25,37.08 81.4,37.08 81.85,37.54 81.85,38.22 U$4.13
  Bottom 0.305: v80.94,39.82 82.08,39.82 83,40.74 96.66,40.74 107.18,51.25 140.83,51.25 LED7.C
N$22  (via drill 0.3)
  Top 0.305: v88.25,40.05 83.23,40.05 82.54,39.36 82.54,38.45 U$4.14
  Bottom 0.305: v88.25,40.05 106.77,40.05 110.66,36.16 112.26,36.16 LED8.C
N$23  (via drill 0.3)
  Top 0.305: v87.11,38.91 86.43,39.59 83.45,39.59 83.23,39.36 83.23,38.45 U$4.15
  Bottom 0.305: v87.11,38.91 93.06,32.96 93.06,26.11 93.28,25.88 94.43,25.88 LED9.C
N$24  (via drill 0.3)
  Top 0.305: v80.94,34.56 83.68,37.31 83.68,38.22 U$4.16
  Bottom 0.305: v80.94,34.56 80.94,21.76 75.45,16.28 74.54,16.28 LED10.C
N$25  (via drill 0.3)
  Top 0.305: v80.25,33.88 81.63,33.88 84.37,36.62 84.37,38.22 U$4.17
  Bottom 0.305: v80.25,33.88 60.14,13.76 60.14,12.39 56.94,9.19 56.02,9.19 LED11.C
N$26  (via drill 0.3)
  Top 0.305: v78.2,33.19 81.85,33.19 85.28,36.62 85.28,37.31 85.05,37.54 85.05,38.22 U$4.18
  Bottom 0.305: v78.2,33.19 63.79,33.19 42.99,12.39 42.99,9.42 39.11,5.53 38.19,5.53 LED12.C
N$27
  Top 0.305: 85.74,56.05 U$1.7 | 92.6,51.02 U$5.2 92.83,50.79 93.51,50.11 | 93.51,46.45 C5.2
  Top 0.406: 85.74,56.05 87.57,56.05 92.6,51.02
  Top 1.016: 93.51,46.45 93.73,46.67 93.73,50.75 93.53,50.95 U$5.2
N$28
  Top 1.016: BATT.P 10.15,29.28 | 14.28,20.4 S1.6
  Top 1.27: 10.15,29.28 14.28,25.15 14.28,20.4
N$29
  Top 0.305: 85.74,56.97 U$1.8 | 92.6,56.97 U$5.1 92.83,57.2 93.51,57.88 | 93.51,61.54 C6.2
  Top 0.406: 92.6,56.97 85.74,56.97
  Top 1.27: 93.51,61.54 93.51,57.86 U$5.1
N$30  (via drill 0.3)
  Top 0.305: v79.34,54.68 79.11,54.45 77.05,54.45 U$1.20 | v80.25,55.59 82.77,55.59 84.83,57.65 84.83,59.25 81.17,62.91 C7.2
  Bottom 0.305: v80.25,55.59 v79.34,54.68
N$39  (via drill 0.3)
  Top 0.305: v70.88,46.68 76.14,51.94 76.82,51.94 U$1.23 | v69.97,45.77 69.97,40.51 60.82,31.36 59.45,31.36 R17.2
  Bottom 0.305: v69.97,45.77 v70.88,46.68
N$40
  Top 0.305: C10.2 54.88,61.77 54.88,62.22 58.31,65.65 58.31,66.8 LCD1.2
N$41
  Top 0.305: C10.1 52.14,61.77 52.59,61.77 57.62,66.8 LCD1.1
N$42
  Top 0.305: C11.2 54.88,56.05 54.88,58.8 59.68,63.6 59.68,66.8 LCD1.4
N$43
  Top 0.305: C11.1 52.14,56.05 52.14,56.74 58.99,63.6 58.99,66.8 LCD1.3
N$44
  Top 0.305: R18.2 64.94,70.91 64.94,68.85 65.39,68.4 65.39,67.02 LCD1.13
N$45  (via drill 0.5)
  Top 0.305: v66.13,69.55 LCD1.14
  Top 0.406: C9.1 54.73,68.15 v57.14,70.56
  Bottom 0.406: v57.14,70.56 65.12,70.56 65.13,70.55 v66.13,69.55
N$51
  Top 0.406: LCD1.15 69.95,66.98 C8.1
N$52
  Top 0.305: 54.65,42.79 C12.1 | 54.65,49.42 C13.1 54.88,49.65 54.88,52.5 58.54,56.15 58.54,61.77 60.59,63.82 60.59,65.2 | 61.74,65.2 61.51,65.42 61.51,66.8 LCD1.7 | 61.74,65.2 64.02,62.91 64.94,62.91 66.54,61.31 66.54,59.48 71.8,54.22 72.25,54.22 SJ2.2 | 60.59,65.2 60.37,65.42 60.37,66.8 LCD1.5 | 61.74,65.2 60.59,65.2
  Top 1.27: 54.65,42.79 54.65,49.52 C13.1
OLED_CS  (via drill 0.3)
  Top 0.305: v73.17,58.57 73.4,58.34 78.42,58.34 U$1.16 | v70.2,59.71 68.82,59.71 65.17,63.37 64.25,63.37 62.19,65.42 62.19,66.8 LCD1.8
  Bottom 0.305: v73.17,58.57 72.02,59.71 v70.2,59.71
OLED_DC  (via drill 0.3)
  Top 0.305: v78.2,60.17 79.11,59.25 79.11,58.34 U$1.15 | v77.28,61.08 70.42,61.08 67.22,64.28 64.71,64.28 63.57,65.42 63.57,66.8 LCD1.10
  Bottom 0.305: v77.28,61.08 v78.2,60.17
OLED_PIN_PWR
  Top 0.305: U$1.11 82.31,58.34 82.31,59.25 80.71,60.85 77.97,60.85 76.37,59.25 72.94,59.25 72.48,58.8 72.48,55.59 SJ2.1
OLED_RES  (via drill 0.3)
  Top 0.305: v73.17,57.65 73.85,56.97 76.82,56.97 U$1.17 | v71.8,59.02 66.99,63.82 64.48,63.82 62.88,65.42 62.88,66.8 LCD1.9
  Bottom 0.305: v71.8,59.02 v73.17,57.65
OLED_SCLK  (via drill 0.3)
  Top 0.305: v79.11,60.17 80.02,59.25 80.02,58.34 U$1.14 | v77.05,62 70.2,62 67.45,64.74 64.94,64.74 64.25,65.42 64.25,66.8 LCD1.11
  Bottom 0.305: v79.11,60.17 77.28,62 v77.05,62
OLED_SDIN  (via drill 0.3)
  Top 0.305: v80.02,60.17 80.71,59.48 80.71,58.34 U$1.13 | v76.37,62.68 70.2,62.68 67.68,65.2 65.17,65.2 64.94,65.42 64.94,66.8 LCD1.12
  Bottom 0.305: v80.02,60.17 77.51,62.68 v76.37,62.68
RESET
  Top 0.305: U$1.29 81.63,49.88 81.63,50.57 81.4,50.79 77.97,50.79 74.54,47.37 74.54,46.45 R13.1
SHIFT_CLR
  Top 0.305: U$1.25 78.65,49.65 78.65,47.14 81.17,44.62 81.17,43.94 U$4.9
SHIFT_G
  Top 0.305: U$1.1 85.74,51.02 85.74,50.34 88.71,47.37 88.71,43.94 86.43,41.65 80.94,41.65 80.48,42.11 80.48,43.71 U$4.10
SHIFT_RCLK  (via drill 0.3)
  Top 0.305: v81.4,45.31 79.34,47.37 79.34,49.65 U$1.26 | v81.85,40.51 81.85,39.82 81.17,39.14 81.17,38.45 U$4.12
  Bottom 0.305: v81.4,45.31 81.4,43.02 81.85,42.56 v81.85,40.51
SHIFT_SCLK  (via drill 0.3)
  Top 0.305: v81.17,47.82 80.94,48.05 80.94,49.65 U$1.28 | v97.88,47.37 97.88,46.12 88.84,37.08 85.97,37.08 85.74,37.31 85.74,38.22 U$4.19
  Bottom 0.305: v81.17,47.82 81.85,47.82 85.05,44.62 87.57,44.62 90.31,47.37 v97.88,47.37
SHIFT_SDATA  (via drill 0.3)
  Top 0.305: v84.14,47.37 83.23,46.45 81.4,46.45 80.25,47.59 80.25,49.65 U$1.27 | v85.97,45.77 85.97,45.08 85.74,44.85 85.74,43.94 U$4.2
  Bottom 0.305: v84.14,47.37 85.74,45.77 v85.97,45.77
SW_INPUT  (via drill 0.3)
  Top 0.305: v81.63,47.14 82.08,47.14 83.91,48.97 83.91,49.65 U$1.32 | v75,40.51 72.48,40.51 R16.1 72.25,40.28
  Bottom 0.305: 29.05,47.14 SW1.B2 | 35.22,47.14 SW1.B1 | v75,40.51 v81.63,47.14
  Bottom 1.27: 29.05,47.14 35.11,47.14 SW1.B1 38.76,47.03 45.71,40.08 50.79,35 69.84,35 75,40.15 v75,40.51
VBATT
  Top 0.305: U$3.8 U$3.7 U$3.6 13.01,75.78 | U$3.5 9.96,74.24 | 13.19,75.51 13.01,75.32 | 57.39,31.36 R17.1 | 16.92,46.44 17.13,45.8
  Top 0.406: U$3.7 U$3.6 | 9.96,74.24 10.47,73.73 12.69,73.73 13.01,74.05 13.01,75.32 13.01,75.78
  Top 0.61: C1.1 13.19,75.51
  Top 1.27: S1.7 10.63,20.18 10.63,22.75 9.83,23.55 6.43,23.55 1.23,29.35 1.23,37.05 17.13,45.8 C1.1 | 16.92,46.44 23.13,46.43 45.71,46.43 48.25,43.89 48.25,40.08 57.14,31.19 R17.1

### Text on the board
tPlace: XmasCard v1.1 | CC BY-SA 4.0 / http://github.com/mjholmes | Remove if stored | CR2 Battery | Colin the Aardvark / production | OFF | ON